# EasyEDA Pro project 外接板20260106_改.eprj, schematic Schematic1
Board Name: Board1; Create Date: 2026-01-06; Page Name: P1; Project Name: 外接板20260106_改; Schematic Name: Schematic1; Update Date: 2026-01-06; Company: 嘉立创EDA; Page Size: A4; Version: V1.0
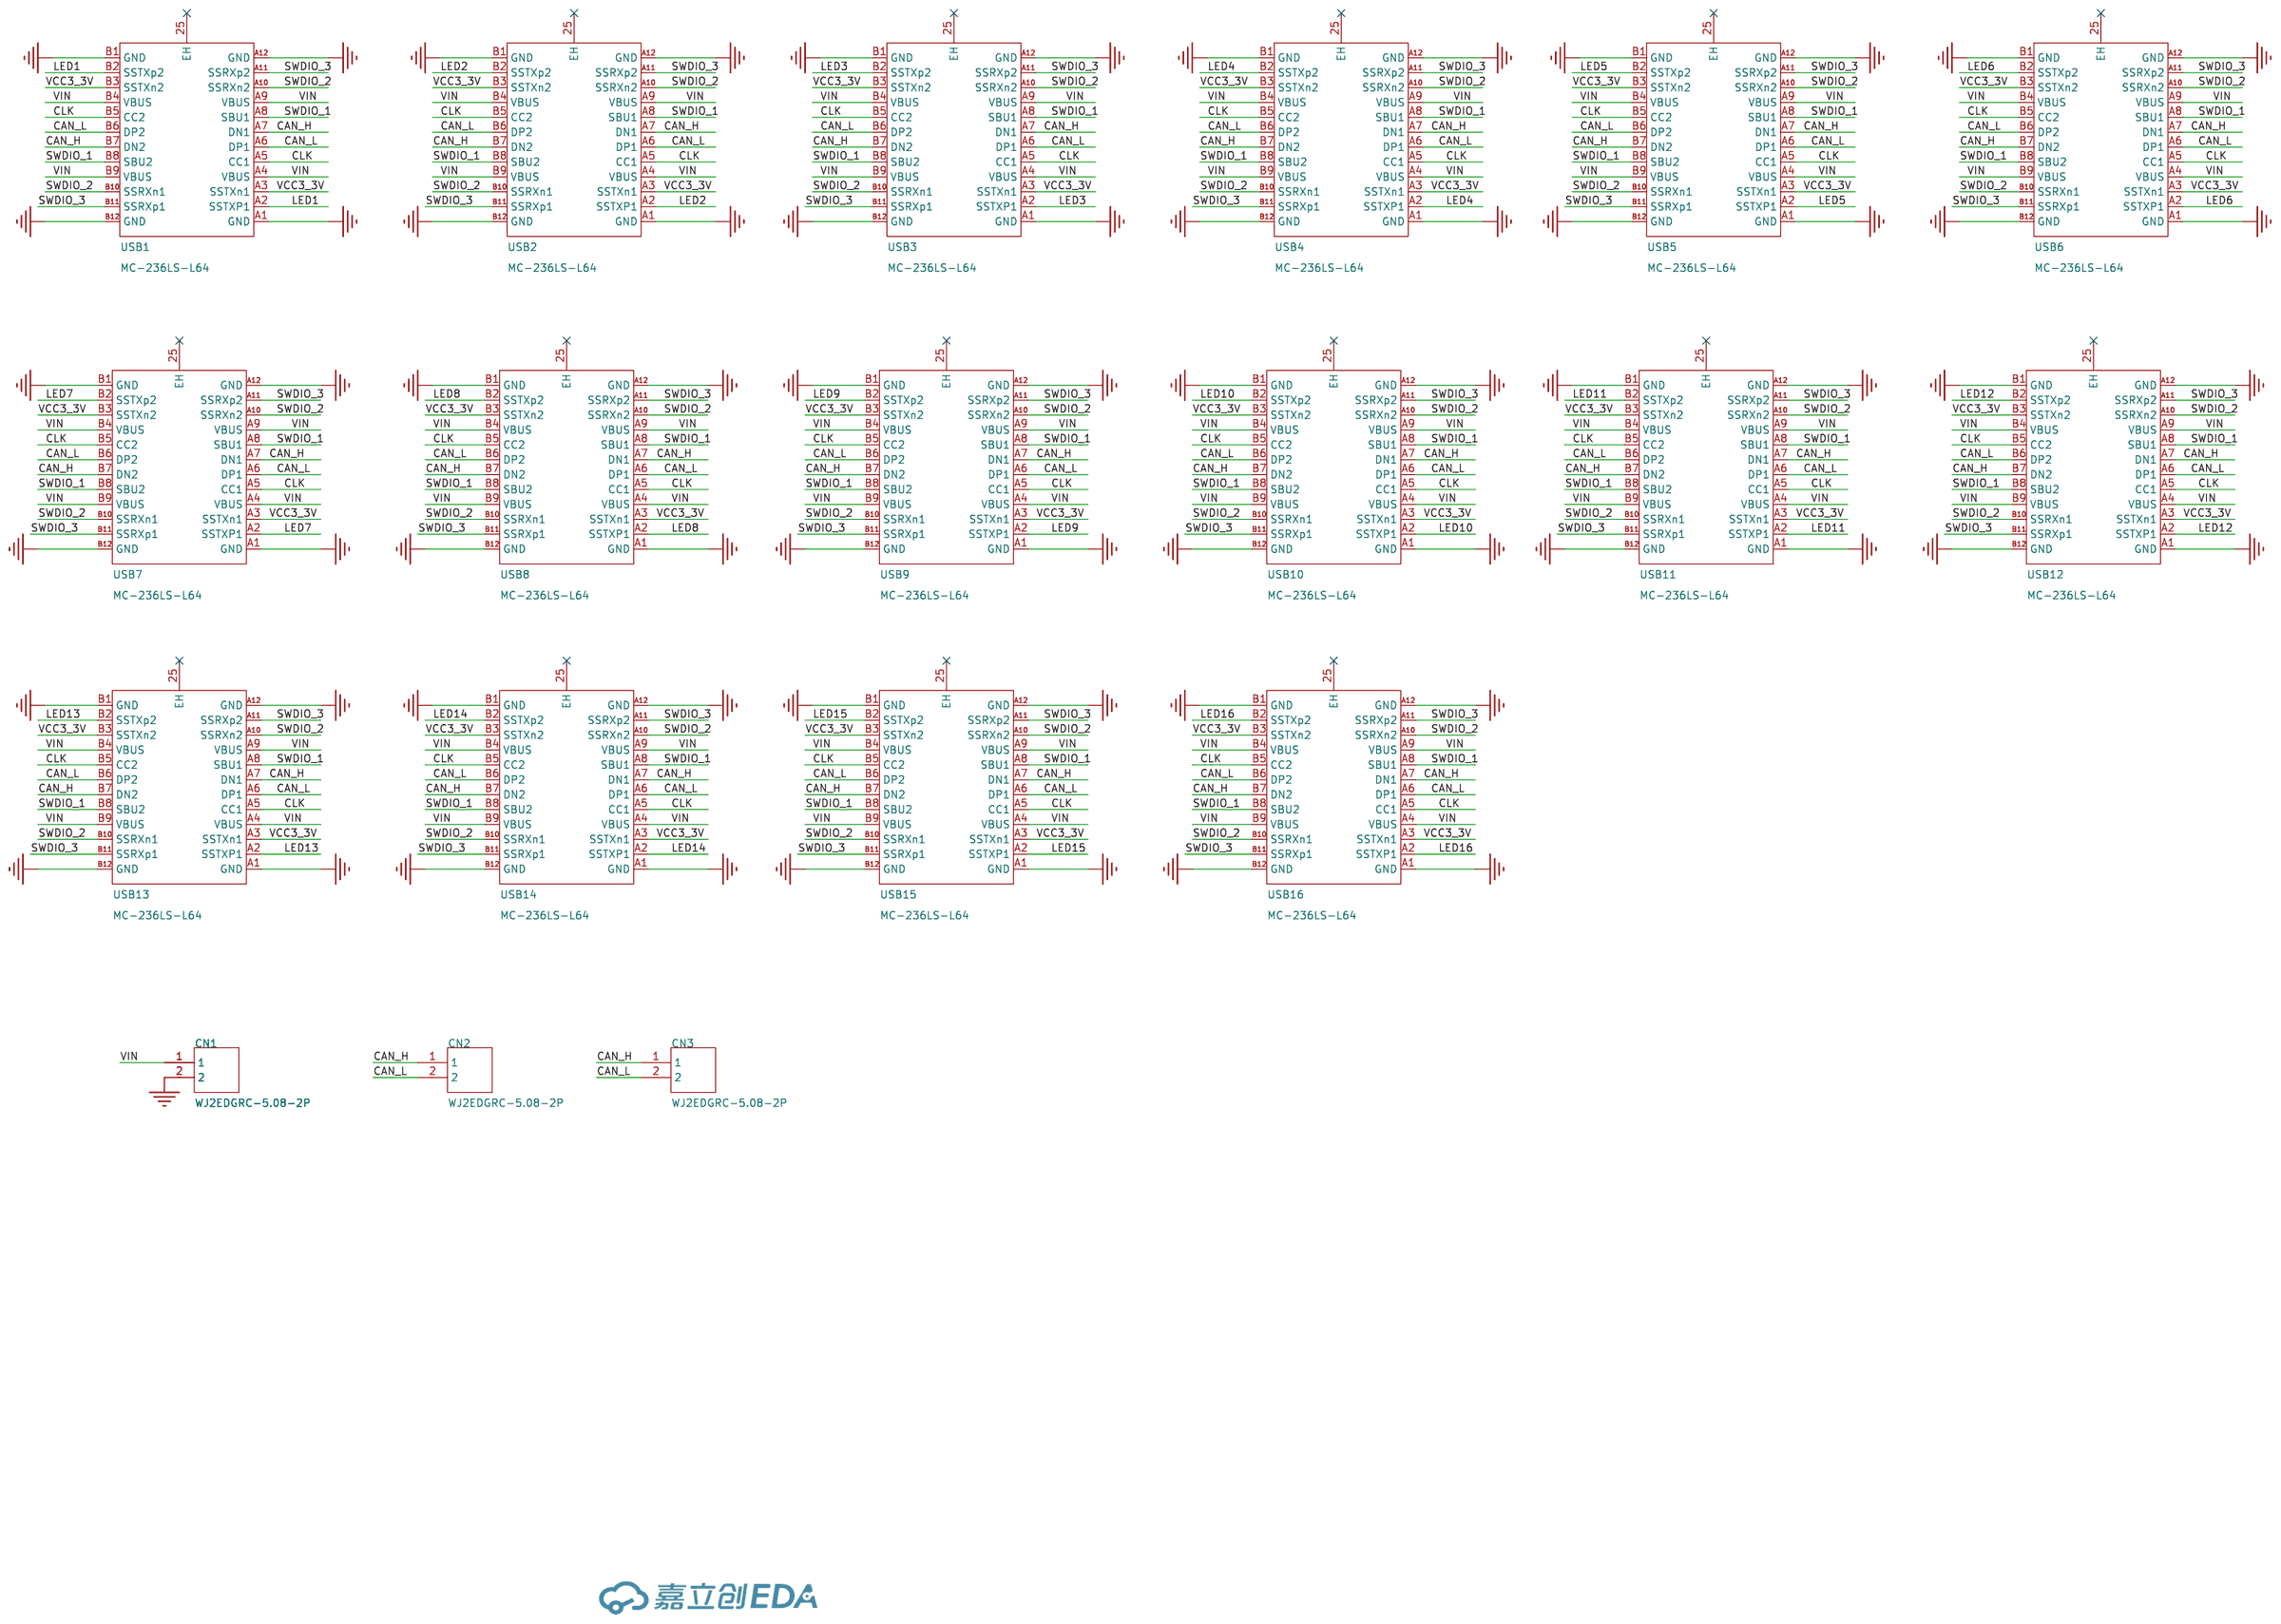
[diagram p0: schematic sheet]

## Parts
CN1  WJ2EDGRC-5.08-2P  [CONN-TH_2P-P5.08_WJ2EDGRC-5.08-2P]
CN2  WJ2EDGRC-5.08-2P  [CONN-TH_2P-P5.08_WJ2EDGRC-5.08-2P]
CN3  WJ2EDGRC-5.08-2P  [CONN-TH_2P-P5.08_WJ2EDGRC-5.08-2P]
USB1  MC-236LS-L64  [TYPE-C-USB-SMD_TYPE-C-31-M-06]
USB2  MC-236LS-L64  [TYPE-C-USB-SMD_TYPE-C-31-M-06]
USB3  MC-236LS-L64  [TYPE-C-USB-SMD_TYPE-C-31-M-06]
USB4  MC-236LS-L64  [TYPE-C-USB-SMD_TYPE-C-31-M-06]
USB5  MC-236LS-L64  [TYPE-C-USB-SMD_TYPE-C-31-M-06]
USB6  MC-236LS-L64  [TYPE-C-USB-SMD_TYPE-C-31-M-06]
USB7  MC-236LS-L64  [TYPE-C-USB-SMD_TYPE-C-31-M-06]
USB8  MC-236LS-L64  [TYPE-C-USB-SMD_TYPE-C-31-M-06]
USB9  MC-236LS-L64  [TYPE-C-USB-SMD_TYPE-C-31-M-06]
USB10  MC-236LS-L64  [TYPE-C-USB-SMD_TYPE-C-31-M-06]
USB11  MC-236LS-L64  [TYPE-C-USB-SMD_TYPE-C-31-M-06]
USB12  MC-236LS-L64  [TYPE-C-USB-SMD_TYPE-C-31-M-06]
USB13  MC-236LS-L64  [TYPE-C-USB-SMD_TYPE-C-31-M-06]
USB14  MC-236LS-L64  [TYPE-C-USB-SMD_TYPE-C-31-M-06]
USB15  MC-236LS-L64  [TYPE-C-USB-SMD_TYPE-C-31-M-06]
USB16  MC-236LS-L64  [TYPE-C-USB-SMD_TYPE-C-31-M-06]

## Library data of the parts
CN1-CN3 = WJ2EDGRC-5.08-2P: 连接器类型:板端/插座-闭口;固定方式:-;结构:1x2P;间距:5.08mm;颜色:绿色;安装方式:弯针;排数:1;每排PIN数:2;额定电流:20A;额定电压:450V;线规 - AWG:-;线规 - 平方毫米:-;触头材质:黄铜;触头镀层:锡;工作温度范围:-40℃~+105℃;焊接温度(最大值):-;; LCSC Part Name: 1x2P 5.08mm 排数:1 每排P数:2; Supplier Part: C3697; Manufacturer: KANGNEX(康奈克斯电气); Supplier Footprint: 弯插,P=5.08mm; JLCPCB Part Class: 扩展库; Datasheet: https://atta.szlcsc.com/upload/public/pdf/source/20240813/4D8AF133EBD88DD18E5AA0CE5EC77AA3.pdf; Supplier: LCSC; Connector Type: 板端/插座-闭口; Structure: 1x2P; Pitch: 5.08mm; Color: 绿色; Mounting Style: 弯针; Number of Pins: 2P; Number of Rows: 1; Number of PINs Per Row: 2; Current Rating (Max): 20A; Voltage Rating (Max): 450V; Contact Material: 黄铜; Contact Plating: 锡; Operating Temperature Range: -40℃~+105℃
USB1-USB16 = MC-236LS-L64: LCSC Part Name: Type-C 母 立贴; Supplier Part: C3039314; Manufacturer: HANBO(汉博); Supplier Footprint: SMD; JLCPCB Part Class: 扩展库; Datasheet: https://item.szlcsc.com/datasheet/MC-236LS-L64/3592990.html; Supplier: LCSC; Connector Type: Type-C; Protocol Standard: USB 3.1; Gender: 母; Mounting Type: 立贴; Number of Contacts: 24P; Number of Ports: 1; Current Rating-Power: 5A; Voltage Rating: 5V; Connect-Disconnect Life: 1万次; Operating Temperature: -25℃~+85℃

## Nets
GND: CN1.2 USB1.A1(GND) USB1.A12(GND) USB1.B1(GND) USB1.B12(GND) USB2.A1(GND) USB2.A12(GND) USB2.B1(GND) USB2.B12(GND) USB3.A1(GND) USB3.A12(GND) USB3.B1(GND) USB3.B12(GND) USB4.A1(GND) USB4.A12(GND) USB4.B1(GND) USB4.B12(GND) USB5.A1(GND) USB5.A12(GND) USB5.B1(GND) USB5.B12(GND) USB6.A1(GND) USB6.A12(GND) USB6.B1(GND) USB6.B12(GND) USB7.A1(GND) USB7.A12(GND) USB7.B1(GND) USB7.B12(GND) USB8.A1(GND) USB8.A12(GND) USB8.B1(GND) USB8.B12(GND) USB9.A1(GND) USB9.A12(GND) USB9.B1(GND) USB9.B12(GND) USB10.A1(GND) USB10.A12(GND) USB10.B1(GND) USB10.B12(GND) USB11.A1(GND) USB11.A12(GND) USB11.B1(GND) USB11.B12(GND) USB12.A1(GND) USB12.A12(GND) USB12.B1(GND) USB12.B12(GND) USB13.A1(GND) USB13.A12(GND) USB13.B1(GND) USB13.B12(GND) USB14.A1(GND) USB14.A12(GND) USB14.B1(GND) USB14.B12(GND) USB15.A1(GND) USB15.A12(GND) USB15.B1(GND) USB15.B12(GND) USB16.A1(GND) USB16.A12(GND) USB16.B1(GND) USB16.B12(GND)
VCC3_3V: USB1.A3(SSTXn1) USB1.B3(SSTXn2) USB2.A3(SSTXn1) USB2.B3(SSTXn2) USB3.A3(SSTXn1) USB3.B3(SSTXn2) USB4.A3(SSTXn1) USB4.B3(SSTXn2) USB5.A3(SSTXn1) USB5.B3(SSTXn2) USB6.A3(SSTXn1) USB6.B3(SSTXn2) USB7.A3(SSTXn1) USB7.B3(SSTXn2) USB8.A3(SSTXn1) USB8.B3(SSTXn2) USB9.A3(SSTXn1) USB9.B3(SSTXn2) USB10.A3(SSTXn1) USB10.B3(SSTXn2) USB11.A3(SSTXn1) USB11.B3(SSTXn2) USB12.A3(SSTXn1) USB12.B3(SSTXn2) USB13.A3(SSTXn1) USB13.B3(SSTXn2) USB14.A3(SSTXn1) USB14.B3(SSTXn2) USB15.A3(SSTXn1) USB15.B3(SSTXn2) USB16.A3(SSTXn1) USB16.B3(SSTXn2)
VIN: CN1.1 USB1.A4(VBUS) USB1.A9(VBUS) USB1.B4(VBUS) USB1.B9(VBUS) USB2.A4(VBUS) USB2.A9(VBUS) USB2.B4(VBUS) USB2.B9(VBUS) USB3.A4(VBUS) USB3.A9(VBUS) USB3.B4(VBUS) USB3.B9(VBUS) USB4.A4(VBUS) USB4.A9(VBUS) USB4.B4(VBUS) USB4.B9(VBUS) USB5.A4(VBUS) USB5.A9(VBUS) USB5.B4(VBUS) USB5.B9(VBUS) USB6.A4(VBUS) USB6.A9(VBUS) USB6.B4(VBUS) USB6.B9(VBUS) USB7.A4(VBUS) USB7.A9(VBUS) USB7.B4(VBUS) USB7.B9(VBUS) USB8.A4(VBUS) USB8.A9(VBUS) USB8.B4(VBUS) USB8.B9(VBUS) USB9.A4(VBUS) USB9.A9(VBUS) USB9.B4(VBUS) USB9.B9(VBUS) USB10.A4(VBUS) USB10.A9(VBUS) USB10.B4(VBUS) USB10.B9(VBUS) USB11.A4(VBUS) USB11.A9(VBUS) USB11.B4(VBUS) USB11.B9(VBUS) USB12.A4(VBUS) USB12.A9(VBUS) USB12.B4(VBUS) USB12.B9(VBUS) USB13.A4(VBUS) USB13.A9(VBUS) USB13.B4(VBUS) USB13.B9(VBUS) USB14.A4(VBUS) USB14.A9(VBUS) USB14.B4(VBUS) USB14.B9(VBUS) USB15.A4(VBUS) USB15.A9(VBUS) USB15.B4(VBUS) USB15.B9(VBUS) USB16.A4(VBUS) USB16.A9(VBUS) USB16.B4(VBUS) USB16.B9(VBUS)
CAN_H: CN2.1 CN3.1 USB1.A7(DN1) USB1.B7(DN2) USB2.A7(DN1) USB2.B7(DN2) USB3.A7(DN1) USB3.B7(DN2) USB4.A7(DN1) USB4.B7(DN2) USB5.A7(DN1) USB5.B7(DN2) USB6.A7(DN1) USB6.B7(DN2) USB7.A7(DN1) USB7.B7(DN2) USB8.A7(DN1) USB8.B7(DN2) USB9.A7(DN1) USB9.B7(DN2) USB10.A7(DN1) USB10.B7(DN2) USB11.A7(DN1) USB11.B7(DN2) USB12.A7(DN1) USB12.B7(DN2) USB13.A7(DN1) USB13.B7(DN2) USB14.A7(DN1) USB14.B7(DN2) USB15.A7(DN1) USB15.B7(DN2) USB16.A7(DN1) USB16.B7(DN2)
CAN_L: CN2.2 CN3.2 USB1.A6(DP1) USB1.B6(DP2) USB2.A6(DP1) USB2.B6(DP2) USB3.A6(DP1) USB3.B6(DP2) USB4.A6(DP1) USB4.B6(DP2) USB5.A6(DP1) USB5.B6(DP2) USB6.A6(DP1) USB6.B6(DP2) USB7.A6(DP1) USB7.B6(DP2) USB8.A6(DP1) USB8.B6(DP2) USB9.A6(DP1) USB9.B6(DP2) USB10.A6(DP1) USB10.B6(DP2) USB11.A6(DP1) USB11.B6(DP2) USB12.A6(DP1) USB12.B6(DP2) USB13.A6(DP1) USB13.B6(DP2) USB14.A6(DP1) USB14.B6(DP2) USB15.A6(DP1) USB15.B6(DP2) USB16.A6(DP1) USB16.B6(DP2)
CLK: USB1.A5(CC1) USB1.B5(CC2) USB2.A5(CC1) USB2.B5(CC2) USB3.A5(CC1) USB3.B5(CC2) USB4.A5(CC1) USB4.B5(CC2) USB5.A5(CC1) USB5.B5(CC2) USB6.A5(CC1) USB6.B5(CC2) USB7.A5(CC1) USB7.B5(CC2) USB8.A5(CC1) USB8.B5(CC2) USB9.A5(CC1) USB9.B5(CC2) USB10.A5(CC1) USB10.B5(CC2) USB11.A5(CC1) USB11.B5(CC2) USB12.A5(CC1) USB12.B5(CC2) USB13.A5(CC1) USB13.B5(CC2) USB14.A5(CC1) USB14.B5(CC2) USB15.A5(CC1) USB15.B5(CC2) USB16.A5(CC1) USB16.B5(CC2)
LED1: USB1.A2(SSTXP1) USB1.B2(SSTXp2)
LED2: USB2.A2(SSTXP1) USB2.B2(SSTXp2)
LED3: USB3.A2(SSTXP1) USB3.B2(SSTXp2)
LED4: USB4.A2(SSTXP1) USB4.B2(SSTXp2)
LED5: USB5.A2(SSTXP1) USB5.B2(SSTXp2)
LED6: USB6.A2(SSTXP1) USB6.B2(SSTXp2)
LED7: USB7.A2(SSTXP1) USB7.B2(SSTXp2)
LED8: USB8.A2(SSTXP1) USB8.B2(SSTXp2)
LED9: USB9.A2(SSTXP1) USB9.B2(SSTXp2)
LED10: USB10.A2(SSTXP1) USB10.B2(SSTXp2)
LED11: USB11.A2(SSTXP1) USB11.B2(SSTXp2)
LED12: USB12.A2(SSTXP1) USB12.B2(SSTXp2)
LED13: USB13.A2(SSTXP1) USB13.B2(SSTXp2)
LED14: USB14.A2(SSTXP1) USB14.B2(SSTXp2)
LED15: USB15.A2(SSTXP1) USB15.B2(SSTXp2)
LED16: USB16.A2(SSTXP1) USB16.B2(SSTXp2)
SWDIO_1: USB1.A8(SBU1) USB1.B8(SBU2) USB2.A8(SBU1) USB2.B8(SBU2) USB3.A8(SBU1) USB3.B8(SBU2) USB4.A8(SBU1) USB4.B8(SBU2) USB5.A8(SBU1) USB5.B8(SBU2) USB6.A8(SBU1) USB6.B8(SBU2) USB7.A8(SBU1) USB7.B8(SBU2) USB8.A8(SBU1) USB8.B8(SBU2) USB9.A8(SBU1) USB9.B8(SBU2) USB10.A8(SBU1) USB10.B8(SBU2) USB11.A8(SBU1) USB11.B8(SBU2) USB12.A8(SBU1) USB12.B8(SBU2) USB13.A8(SBU1) USB13.B8(SBU2) USB14.A8(SBU1) USB14.B8(SBU2) USB15.A8(SBU1) USB15.B8(SBU2) USB16.A8(SBU1) USB16.B8(SBU2)
SWDIO_2: USB1.A10(SSRXn2) USB1.B10(SSRXn1) USB2.A10(SSRXn2) USB2.B10(SSRXn1) USB3.A10(SSRXn2) USB3.B10(SSRXn1) USB4.A10(SSRXn2) USB4.B10(SSRXn1) USB5.A10(SSRXn2) USB5.B10(SSRXn1) USB6.A10(SSRXn2) USB6.B10(SSRXn1) USB7.A10(SSRXn2) USB7.B10(SSRXn1) USB8.A10(SSRXn2) USB8.B10(SSRXn1) USB9.A10(SSRXn2) USB9.B10(SSRXn1) USB10.A10(SSRXn2) USB10.B10(SSRXn1) USB11.A10(SSRXn2) USB11.B10(SSRXn1) USB12.A10(SSRXn2) USB12.B10(SSRXn1) USB13.A10(SSRXn2) USB13.B10(SSRXn1) USB14.A10(SSRXn2) USB14.B10(SSRXn1) USB15.A10(SSRXn2) USB15.B10(SSRXn1) USB16.A10(SSRXn2) USB16.B10(SSRXn1)
SWDIO_3: USB1.A11(SSRXp2) USB1.B11(SSRXp1) USB2.A11(SSRXp2) USB2.B11(SSRXp1) USB3.A11(SSRXp2) USB3.B11(SSRXp1) USB4.A11(SSRXp2) USB4.B11(SSRXp1) USB5.A11(SSRXp2) USB5.B11(SSRXp1) USB6.A11(SSRXp2) USB6.B11(SSRXp1) USB7.A11(SSRXp2) USB7.B11(SSRXp1) USB8.A11(SSRXp2) USB8.B11(SSRXp1) USB9.A11(SSRXp2) USB9.B11(SSRXp1) USB10.A11(SSRXp2) USB10.B11(SSRXp1) USB11.A11(SSRXp2) USB11.B11(SSRXp1) USB12.A11(SSRXp2) USB12.B11(SSRXp1) USB13.A11(SSRXp2) USB13.B11(SSRXp1) USB14.A11(SSRXp2) USB14.B11(SSRXp1) USB15.A11(SSRXp2) USB15.B11(SSRXp1) USB16.A11(SSRXp2) USB16.B11(SSRXp1)

Not connected (* = marked no-connect by the designer): USB1 25(EH)*; USB2 25(EH)*; USB3 25(EH)*; USB4 25(EH)*; USB5 25(EH)*; USB6 25(EH)*; USB7 25(EH)*; USB8 25(EH)*; USB9 25(EH)*; USB10 25(EH)*; USB11 25(EH)*; USB12 25(EH)*; USB13 25(EH)*; USB14 25(EH)*; USB15 25(EH)*; USB16 25(EH)*
